# Altium schematic sheet Connections.SchDoc
size A; SheetNumber: 4; SheetTotal: 4
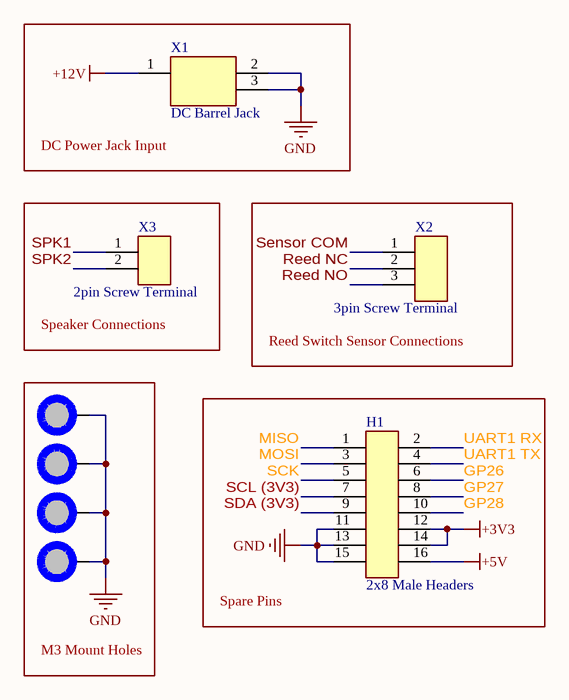
[diagram p0: Connections.SchDoc]

## Parts
H1  2x8 Male Headers  [[Header] 2x8 Male Headers]
Mount1  M3 Mount Hole  [[Mount] M3 Mount Hole]  (value not drawn)  (no BOM)
Mount2  M3 Mount Hole  [[Mount] M3 Mount Hole]  (value not drawn)  (no BOM)
Mount3  M3 Mount Hole  [[Mount] M3 Mount Hole]  (value not drawn)  (no BOM)
Mount4  M3 Mount Hole  [[Mount] M3 Mount Hole]  (value not drawn)  (no BOM)
X1  DC Barrel Jack  [[Port] DC Barrel Jack]
X2  3pin Screw Terminal  [[Screw Terminal] 3pin 5mm]
X3  2pin Screw Terminal  [[Screw Terminal] 2pin 5mm]

## Blocks framed on the sheet
DC Power Jack Input: X1
Speaker Connections: X3
Reed Switch Sensor Connections: X2
M3 Mount Holes: Mount1-Mount4
Spare Pins: H1

## Nets
+3V3: H1.12 H1.14
+5V: H1.16
+12V: X1.1(Pin)
GND: H1.11 H1.13 H1.15 Mount1.1 Mount2.1 Mount3.1 Mount4.1 X1.2(Barrel) X1.3(Barrel)
GP26: H1.6
GP27: H1.8
GP28: H1.10
MISO: H1.1
MOSI: H1.3
Reed NC: X2.2
Reed NO: X2.3
SCK: H1.5
SCL (3V3): H1.7
SDA (3V3): H1.9
Sensor COM: X2.1
SPK1: X3.1
SPK2: X3.2
UART1 RX: H1.2
UART1 TX: H1.4

## Library data of the parts
H1 = [Header] 2x8 Male: 2.54mm pitch
Mount1-Mount4 = [Mount] M3 Mount Hole: Place at least 4.5mm from board edge. Plated.
X1 = [Port] DC Barrel Jack: Pin 1: Pin / Pin2/3: Barrel; Supplier 1: DigiKey; Supplier Part Number 1: CP-102A-ND
X2 = [Screw Terminal] 3pin: Supplier 1: DigiKey; Supplier Part Number 1: 102-6162-ND
X3 = [Screw Terminal] 2pin: Supplier 1: DigiKey; Supplier Part Number 1: 102-6145-ND